# Altium project Wally_BMS.PrjPcb (part 1 of 3)
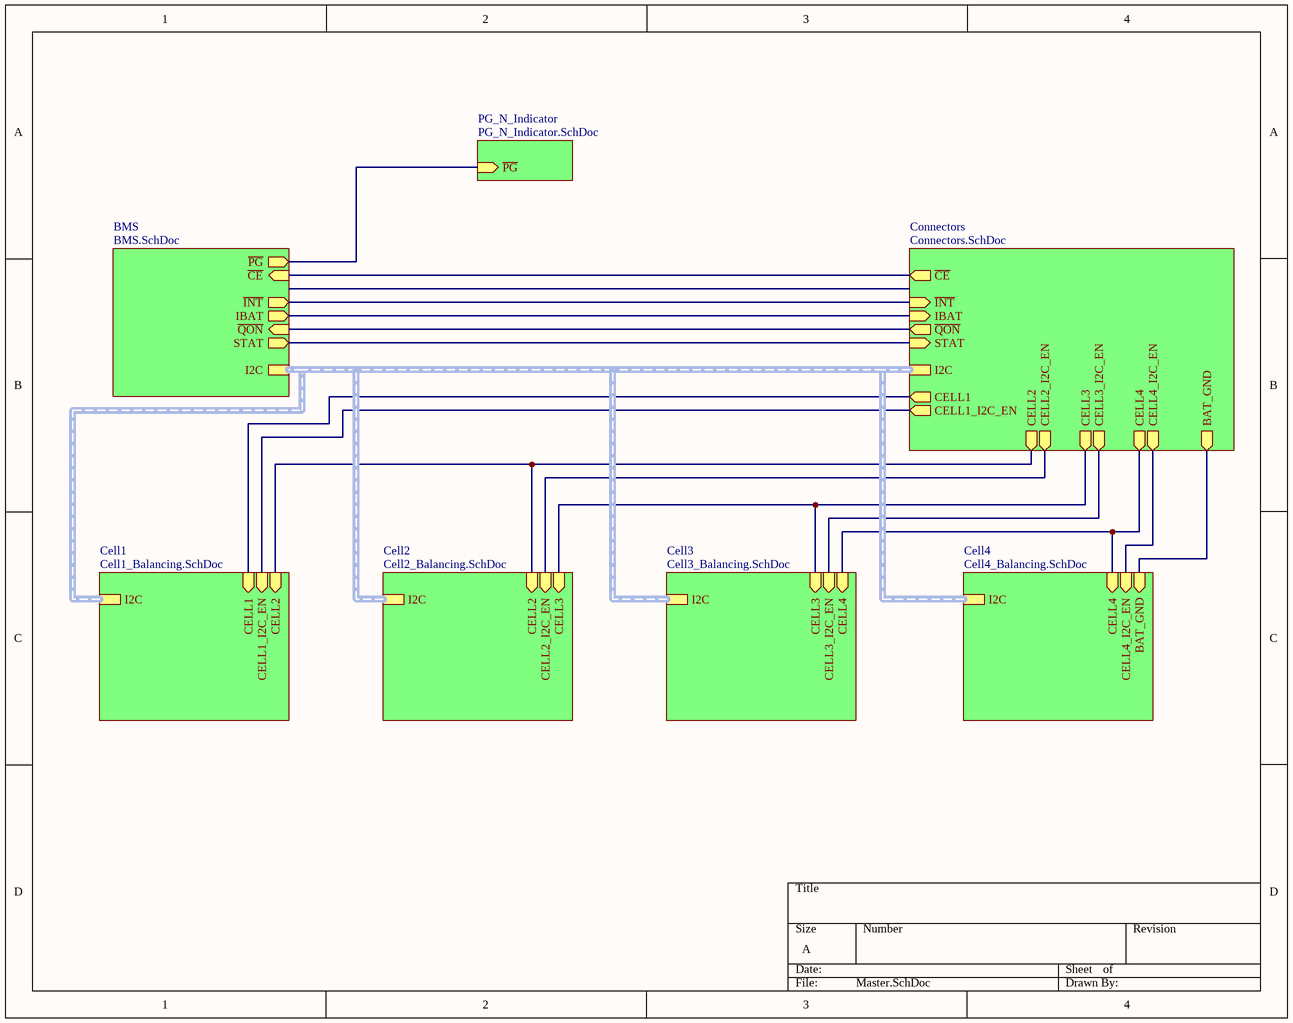
[diagram p0: Master.SchDoc]
8 sheets, 160 parts. Net scope: hierarchical (ports join the sheet entries above them; power ports are global).
Board file: Wally_BMS.PcbDoc
Sheets:
  Master.SchDoc
    BMS = BMS.SchDoc
    Connectors = Connectors.SchDoc
    Cell1 = Cell1_Balancing.SchDoc
    Cell2 = Cell2_Balancing.SchDoc
    Cell3 = Cell3_Balancing.SchDoc
    Cell4 = Cell4_Balancing.SchDoc
    PG_N_Indicator = PG_N_Indicator.SchDoc

## Sheet Master.SchDoc
size A; DocumentNumber: 1; SheetNumber: 1; SheetTotal: 7

### Sub-sheets
BMS = BMS.SchDoc: ~{CE} (in), I2C (harness I2C), ~{INT} (out), IBAT (out), ~{QON} (in), STAT (out), ~{PG} (out)
Cell1 = Cell1_Balancing.SchDoc: I2C (harness I2C), CELL1 (in), CELL2 (in), CELL1_I2C_EN (in)
Cell2 = Cell2_Balancing.SchDoc: I2C (harness I2C), CELL3 (in), CELL2_I2C_EN (in), CELL2 (in)
Cell3 = Cell3_Balancing.SchDoc: I2C (harness I2C), CELL4 (in), CELL3_I2C_EN (in), CELL3 (in)
Cell4 = Cell4_Balancing.SchDoc: BAT_GND (in), CELL4_I2C_EN (in), CELL4 (in), I2C (harness I2C)
Connectors = Connectors.SchDoc: ~{CE} (out), I2C (harness I2C), ~{INT} (in), IBAT (in), ~{QON} (out), STAT (in), CELL1_I2C_EN (out), CELL1 (out), CELL2_I2C_EN (out), CELL2 (out), CELL3_I2C_EN (out), CELL3 (out), CELL4_I2C_EN (out), CELL4 (out), BAT_GND (out)
PG_N_Indicator = PG_N_Indicator.SchDoc: ~{PG} (in)

### Nets
~{CE}: sheet BMS/~{CE}, sheet Connectors/~{CE}
~{INT}: sheet BMS/~{INT}, sheet Connectors/~{INT}
~{PG}: sheet BMS/~{PG}, sheet PG_N_Indicator/~{PG}
~{QON}: sheet BMS/~{QON}, sheet Connectors/~{QON}
BAT_GND: sheet Connectors/BAT_GND, sheet Cell4/BAT_GND
CELL1: sheet Connectors/CELL1, sheet Cell1/CELL1
CELL1_I2C_EN: sheet Connectors/CELL1_I2C_EN, sheet Cell1/CELL1_I2C_EN
CELL2: sheet Connectors/CELL2, sheet Cell1/CELL2, sheet Cell2/CELL2
CELL2_I2C_EN: sheet Connectors/CELL2_I2C_EN, sheet Cell2/CELL2_I2C_EN
CELL3: sheet Connectors/CELL3, sheet Cell2/CELL3, sheet Cell3/CELL3
CELL3_I2C_EN: sheet Connectors/CELL3_I2C_EN, sheet Cell3/CELL3_I2C_EN
CELL4: sheet Connectors/CELL4, sheet Cell3/CELL4, sheet Cell4/CELL4
CELL4_I2C_EN: sheet Connectors/CELL4_I2C_EN, sheet Cell4/CELL4_I2C_EN
IBAT: sheet BMS/IBAT, sheet Connectors/IBAT
STAT: sheet BMS/STAT, sheet Connectors/STAT

### Buses and harness runs
harness sheet BMS/I2C = sheet Cell1/I2C = sheet Cell2/I2C = sheet Cell3/I2C = sheet Cell4/I2C = sheet Connectors/I2C

## Sheet BMS.SchDoc
size A; DocumentNumber: 3; SheetNumber: 3; SheetTotal: 7
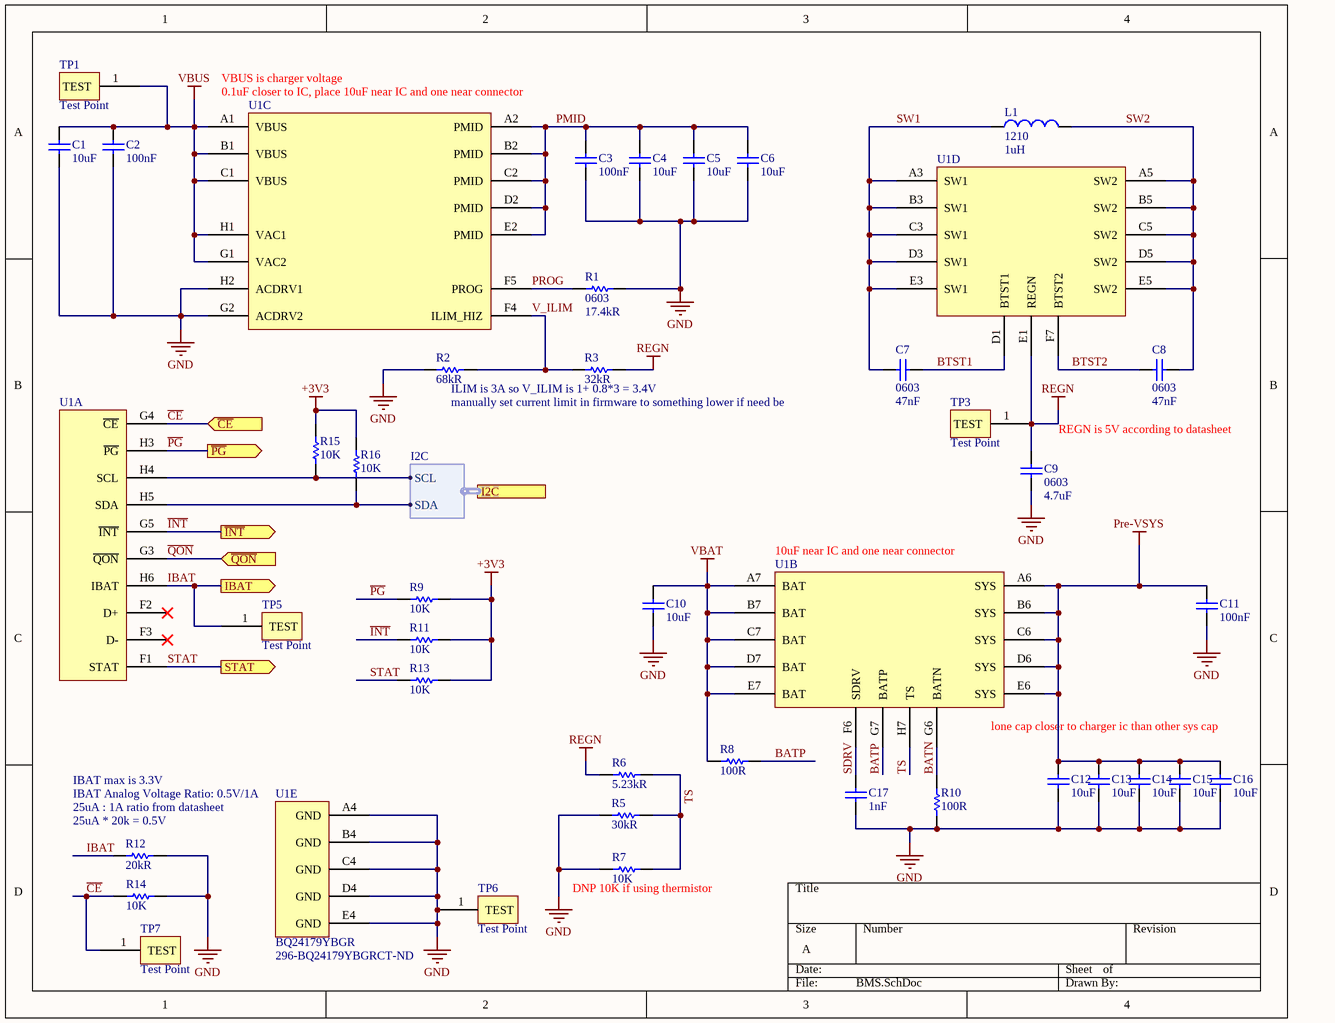
[diagram p1: BMS.SchDoc]

### Parts
C1  Capacitance: 10uF  [C0603]  (hidden comment: Capacitor 0603)
C2  Capacitance: 100nF  [C0402]  (hidden comment: Capacitor 0402)
C3  Capacitance: 100nF  [C0402]  (hidden comment: Capacitor 0402)
C4  Capacitance: 10uF  [C0603]  (hidden comment: Capacitor 0603)
C5  Capacitance: 10uF  [C0603]  (hidden comment: Capacitor 0603)
C6  Capacitance: 10uF  [C0603]  (hidden comment: Capacitor 0603)
C7  Package / Case: 0603  Capacitance: 47nF  [C0603]  (hidden comment: Capacitor 0603)
C8  Package / Case: 0603  Capacitance: 47nF  [C0603]  (hidden comment: Capacitor 0603)
C9  Package / Case: 0603  Capacitance: 4.7uF  [C0603]  (hidden comment: Capacitor 0603)
C10  Capacitance: 10uF  [C0603]  (hidden comment: Capacitor 0603)
C11  Capacitance: 100nF  [C0402]  (hidden comment: Capacitor 0402)
C12  Capacitance: 10uF  [C0603]  (hidden comment: Capacitor 0603)
C13  Capacitance: 10uF  [C0603]  (hidden comment: Capacitor 0603)
C14  Capacitance: 10uF  [C0603]  (hidden comment: Capacitor 0603)
C15  Capacitance: 10uF  [C0603]  (hidden comment: Capacitor 0603)
C16  Capacitance: 10uF  [C0603]  (hidden comment: Capacitor 0603)
C17  Capacitance: 1nF  [C0603]  (hidden comment: 478-1215-1-ND)
L1  Package / Case: 1210  Inductance: 1uH  [ind1210]  (hidden comment: Inductor 1210)
R1  Package / Case: 0603  Resistance: 17.4kR  [RES0603]  (hidden comment: Resistor 0603)
R2  Resistance: 68kR  [RES0402]  (hidden comment: Resistor 0402)
R3  Resistance: 32kR  [RES0402]  (hidden comment: Resistor 0402)
R5  Resistance: 30kR  [RES0402]  (hidden comment: Resistor 0402)
R6  Resistance: 5.23kR  [RES0402]  (hidden comment: Resistor 0402)
R7  Resistance (Ohms): 10K  [RES0603]  (hidden comment: ERJ-PB3B1002V)
R8  Resistance: 100R  [RES0603]  (hidden comment: Resistor 0603)
R9  Resistance (Ohms): 10K  [RES0603]  (hidden comment: ERJ-PB3B1002V)
R10  Resistance: 100R  [RES0603]  (hidden comment: Resistor 0603)
R11  Resistance (Ohms): 10K  [RES0603]  (hidden comment: ERJ-PB3B1002V)
R12  Resistance: 20kR  [RES0603]  (hidden comment: Resistor 0603)
R13  Resistance (Ohms): 10K  [RES0603]  (hidden comment: ERJ-PB3B1002V)
R14  Resistance (Ohms): 10K  [RES0603]  (hidden comment: ERJ-PB3B1002V)
R15  Resistance (Ohms): 10K  [RES0603]  (hidden comment: ERJ-PB3B1002V)
R16  Resistance (Ohms): 10K  [RES0603]  (hidden comment: ERJ-PB3B1002V)
TP1  Test Point  [TEST POINT]
TP3  Test Point  [TEST POINT]
TP5  Test Point  [TEST POINT]
TP6  Test Point  [TEST POINT]
TP7  Test Point  [TEST POINT]
U1  BQ24179YBGR  [BGA_79YBGR_TEX]  (value not drawn)  (parts A,B,C,D,E of 5)

### Ports
I2C (harness I2C), IBAT (out), STAT (out), ~{CE} (in), ~{INT} (out), ~{PG} (out), ~{QON} (in)

### Harnesses
I2C: SDA, SCL

### Nets
+3V3: R9.1 R11.1 R13.1 R15.1 R16.1
GND: C1.1 C2.1 C3.1 C4.1 C5.1 C6.1 C9.1 C10.1 C11.1 C12.1 C13.1 C14.1 C15.1 C16.1 C17.1 R1.1 R2.1 R5.1 R7.2 R10.1 R12.2 R14.1 TP6.1(TEST) U1.A4(GND) U1.B4(GND) U1.C4(GND) U1.D4(GND) U1.E4(GND) U1.G2(ACDRV2) U1.H2(ACDRV1)
Pre-VSYS: C11.2 C12.2 C13.2 C14.2 C15.2 C16.2 U1.A6(SYS) U1.B6(SYS) U1.C6(SYS) U1.D6(SYS) U1.E6(SYS)
REGN: C9.2 R3.2 R6.2 TP3.1(TEST) U1.E1(REGN)
VBAT: C10.2 R8.2 U1.A7(BAT) U1.B7(BAT) U1.C7(BAT) U1.D7(BAT) U1.E7(BAT)
VBUS: C1.2 C2.2 TP1.1(TEST) U1.A1(VBUS) U1.B1(VBUS) U1.C1(VBUS) U1.G1(VAC2) U1.H1(VAC1)
~{CE}: R14.2 TP7.1(TEST) U1.G4(~{CE}) ; port ~{CE}
~{INT}: R11.2 U1.G5(~{INT}) ; port ~{INT}
~{PG}: R9.2 U1.H3(~{PG}) ; port ~{PG}
~{QON}: U1.G3(~{QON}) ; port ~{QON}
BATN: R10.2 U1.G6(BATN)
BATP: R8.1 U1.G7(BATP)
BTST1: C7.2 U1.D1(BTST1)
BTST2: C8.1 U1.F7(BTST2)
IBAT: R12.1 TP5.1(TEST) U1.H6(IBAT) ; port IBAT
PMID: C3.2 C4.2 C5.2 C6.2 U1.A2(PMID) U1.B2(PMID) U1.C2(PMID) U1.D2(PMID) U1.E2(PMID)
PROG: R1.2 U1.F5(PROG)
SCL: R15.2 U1.H4(SCL) ; port I2C.SCL
SDA: R16.2 U1.H5(SDA) ; port I2C.SDA
SDRV: C17.2 U1.F6(SDRV)
STAT: R13.2 U1.F1(STAT) ; port STAT
SW1: C7.1 L1.1 U1.A3(SW1) U1.B3(SW1) U1.C3(SW1) U1.D3(SW1) U1.E3(SW1)
SW2: C8.2 L1.2 U1.A5(SW2) U1.B5(SW2) U1.C5(SW2) U1.D5(SW2) U1.E5(SW2)
TS: R5.2 R6.1 R7.1 U1.H7(TS)
V_ILIM: R2.2 R3.1 U1.F4(ILIM_HIZ)

Not connected (* = marked no-connect by the designer): U1 F2(D+)* F3(D-)*

### Notes on the sheet
- (near U1) VBUS is charger voltage
- (near U1) 0.1uF closer to IC, place 10uF near IC and one near connector
- ILIM is 3A so V_ILIM is 1+ 0.8*3 = 3.4V
- manually set current limit in firmware to something lower if need be
- REGN is 5V according to datasheet
- (near U1) 10uF near IC and one near connector
- (near U1) lone cap closer to charger ic than other sys cap
- IBAT Analog Voltage Ratio: 0.5V/1A
- (near R12) 25uA : 1A ratio from datasheet
- (near R12) 25uA * 20k = 0.5V
- IBAT max is 3.3V
- (near R7) DNP 10K if using thermistor

### Library data of the parts
C1 C4-C6 C10 C12-C16 = Capacitor 0603: Multilayer Ceramic Capacitors (High dielectric type), 25V, 10 uF, ± 20 %, 0603, X5R, RoHS; Manufacturer: Taiyo Yuden; Manufacturer Part Number: TMK107BBJ106MA-T; Tolerance: 20%; Package / Case: 0603; Supplier 1: Digi-Key; Supplier Part Number 1: 587-6023-1-ND; RoHS: Yes; Category: Ceramic Capacitors; Stock 1: 152813; Pricing 1: 1=0.46000, 10=0.32000, 50=0.22380, 100=0.19180, 500=0.14386, 1000=0.12149 (USD); Mount: Surface Mount; Case/Package: 0603; Case Code (Imperial): 0603; Case Code (Metric): 1608; Min Operating Temperature: -55°C; Max Operating Temperature: 85°C; Packaging: Tape and Reel; Voltage Rating: 25V; Lead Free: Lead Free; RoHS Compliant: Yes; ComponentLink1URL: http://ds.yuden.co.jp/TYCOMPAS/ut/detail.do?productNo=TMK107BBJ106MA-T&fileName=TMK107BBJ106MA-T_SS&mode=specSheetDownload&src-supplier=Digi-Key; ComponentLink1Description: http://ds.yuden.co.jp/TYCOMPAS/ut/detail.do?productNo=TMK107BBJ106MA-T&fileName=TMK107BBJ106MA-T_SS&mode=specSheetDownload&src-supplier=Digi-Key
C2 C3 C11 = Capacitor 0402: CAP CER 0.1UF 25V X5R 0402 / High Value Multilayer Ceramic Capacitors (High dielectric type); Manufacturer: Taiyo Yuden; Manufacturer Part Number: TMK105BJ104KV-F; Tolerance: 10%; Package / Case: 0402; Supplier 1: Digi-Key; Supplier Part Number 1: 587-1456-1-ND; RoHS: Yes; Category: Ceramic Capacitors; Stock 1: 2308231; Pricing 1: 1=0.10000, 10=0.04200, 50=0.02280, 100=0.01860, 500=0.01328, 1000=0.01044, 2500=0.00949, 5000=0.00873 (USD); Mount: Surface Mount; Case/Package: 0402; Number of Pins: 2; Case Code (Imperial): 0402; Case Code (Metric): 1005; Weight: 2.3E-05oz; Min Operating Temperature: -55°C; Max Operating Temperature: 85°C; Packaging: Tape and Reel; Dielectric: X5R; Voltage Rating (DC): 25V; Voltage Rating: 25V; Package Quantity: 1; Termination: SMD/SMT; Resistor Type: Ceramic; Voltage: 25V; Series: M; Construction: Flat; Length: 1mm; Width: 0.5mm; Height: 0.5mm; Depth: 0.5mm; Thickness: 0.022inch; REACH SVHC: No SVHC; Lead Free: Lead Free; Halogen Free: Halogen Free; RoHS Compliant: Yes; ComponentLink1URL: https://datasheet.ciiva.com/131/tmk105bj104kv-f-ss-131420.pdf?src-supplier=Digi-Key; ComponentLink1Description: https://datasheet.ciiva.com/131/tmk105bj104kv-f-ss-131420.pdf?src-supplier=Digi-Key; ComponentLink2URL: https://datasheet.ciiva.com/15922/28tmk105bj104kv-f-15922315.pdf?src-supplier=Onlinecomponents.com; ComponentLink2Description: https://datasheet.ciiva.com/15922/28tmk105bj104kv-f-15922315.pdf?src-supplier=Onlinecomponents.com; ComponentLink3URL: https://datasheet.ciiva.com/30051/25tmk105bj104kv-f-30051094.pdf?src-supplier=Onlinecomponents.com; ComponentLink3Description: https://datasheet.ciiva.com/30051/25tmk105bj104kv-f-30051094.pdf?src-supplier=Onlinecomponents.com; ComponentLink4URL: https://datasheet.ciiva.com/22768/1693457-22768649.pdf?src-supplier=Farnell; ComponentLink4Description: https://datasheet.ciiva.com/22768/1693457-22768649.pdf?src-supplier=Farnell
C7 C8 = Capacitor 0603: Cap Ceramic 0.047uF 50V X7R 10% SMD 0603 125°C Paper T/R; Manufacturer: KEMET; Manufacturer Part Number: C0603C473K5RAC7411; Supplier 1: Digi-Key; Supplier Part Number 1: 399-C0603C473K5RAC7411CT-ND; RoHS: Yes; Category: Ceramic Capacitors; Stock 1: 53312; Pricing 1: 1=0.10000, 10=0.07100, 50=0.03860, 100=0.03160, 500=0.02254, 1000=0.01771, 2500=0.01610, 5000=0.01481 (USD); Mount: Surface Mount; Case/Package: 0603; Dielectric Material: Ceramic; Min Operating Temperature: -55°C; Max Operating Temperature: 125°C; Tolerance: 10%; Dielectric: X7R; Voltage Rating (DC): 50V; Construction: Flat; Length: 1.6mm; Height: 0.8mm; Depth: 0.8mm; Radiation Hardening: No; RoHS Compliant: Yes; ComponentLink1URL: http://capacitoredge.kemet.com/capedge2/DataSheet?pn=C0603C473K5RAC7411&src-supplier=Avnet; ComponentLink1Description: http://capacitoredge.kemet.com/capedge2/DataSheet?pn=C0603C473K5RAC7411&src-supplier=Avnet; ComponentLink2URL: http://capacitoredge.kemet.com/capedge2/DataSheet?pn=C0603C473K5RAC7411&src-supplier=Avnet+Europe; ComponentLink2Description: http://capacitoredge.kemet.com/capedge2/DataSheet?pn=C0603C473K5RAC7411&src-supplier=Avnet+Europe
C9 = Capacitor 0603: CAP CER 4.7UF 25V X5R 0603; Manufacturer: TDK; Manufacturer Part Number: C1608X5R1E475M080AC; Dielectric Material: Ceramic; Tolerance: 20%; Supplier 1: Digi-Key; Supplier Part Number 1: 445-9040-1-ND; RoHS: Yes; Category: Ceramic Capacitors; Stock 1: 163174; Pricing 1: 1=0.38000, 10=0.25800, 50=0.17200, 100=0.14620, 500=0.10322, 1000=0.09032 (USD); Mount: Surface Mount; Case/Package: 0603; Case Code (Metric): 1608; Case Code (Imperial): 0603; Weight: 7.1E-05oz; Min Operating Temperature: -55°C; Max Operating Temperature: 85°C; Voltage Rating (DC): 25V; Packaging: Tape and Reel; Voltage Rating: 25V; Termination: SMD/SMT; Series: C; Package Quantity: 1; Dielectric: X5R; Resistor Type: Ceramic; Length: 1.6mm; Width: 0.031inch; Height: 0.8mm; Thickness: 0.039inch; Depth: 0.8mm; Radiation Hardening: No; REACH SVHC: No SVHC; Lead Free: Lead Free; RoHS Compliant: Yes; ComponentLink1URL: https://datasheet.ciiva.com/15192/getdatasheetpartid-726745-15192019.pdf?src-supplier=Verical; ComponentLink1Description: https://datasheet.ciiva.com/15192/getdatasheetpartid-726745-15192019.pdf?src-supplier=Verical
C17 = 06035C102KAT2A: CAP CER 1000PF 50V X7R 0603; Tolerance: ±20%; Applications: General Purpose; Supplier 1: Digi-Key; Supplier Part Number 1: 478-1215-1-ND; Voltage - Rated: 50V; Package / Case: 0603
L1 = Inductor 1210: Inductor Power Shielded Wirewound 1uH 20% 1MHz Metal 4.1A 0.022Ohm DCR 1210 Automotive T/R; Manufacturer: Murata; Manufacturer Part Number: DFE322520FD-1R0M=P2; Supplier 1: Digi-Key; Supplier Part Number 1: 490-18403-1-ND; RoHS: Yes; Category: Fixed Inductors; Stock 1: 831; Pricing 1: 1=0.99000, 10=0.86600, 25=0.80440, 50=0.68060, 100=0.61880, 250=0.58164, 500=0.51976, 1000=0.42075 (USD)
R1 = Resistor 0603: Res Thick Film 0603 17.4K Ohm 1% 0.1W(1/10W) ±100ppm/°C Pad SMD Automotive T/R; Manufacturer: Stackpole Electronics; Manufacturer Part Number: RMCF0603FT17K4; Power Rating: 100mW; Supplier 1: Digi-Key; Supplier Part Number 1: RMCF0603FT17K4CT-ND; RoHS: Yes; Category: Chip SMD Resistors; Stock 1: 31336; Pricing 1: 1=0.10000, 10=0.01700, 100=0.00680, 1000=0.00305, 2500=0.00264 (USD); Mount: Surface Mount; Case/Package: 0603; Case Code (Metric): 1608; Case Code (Imperial): 0603; Contact Plating: Tin,Matte; Size Code: 0603; Min Operating Temperature: -55°C; Max Operating Temperature: 155°C; Tolerance: 1%; Packaging: Tape and Reel; Resistor Type: Thick Film; Number of Terminations: 2; Max Power Dissipation: 100mW; Temperature Coefficient: 100ppm/°C; Features: Automotive AEC-Q200; Series: RMCF; Length: 0.061inch; Width: 0.031inch; Height: 0.022inch; Radiation Hardening: No; Lead Free: Lead Free; RoHS Compliant: Yes; ComponentLink1URL: https://www.seielect.com/catalog/SEI-RMCF_RMCP.pdf?src-supplier=Avnet; ComponentLink1Description: https://www.seielect.com/catalog/SEI-RMCF_RMCP.pdf?src-supplier=Avnet; ComponentLink2URL: https://www.seielect.com/catalog/SEI-Packaging.pdf?src-supplier=Digi-Key; ComponentLink2Description: https://www.seielect.com/catalog/SEI-Packaging.pdf?src-supplier=Digi-Key; ComponentLink3URL: http://www.seielect.com/Catalog/SEI-RMC.pdf?src-supplier=Future+Electronics; ComponentLink3Description: http://www.seielect.com/Catalog/SEI-RMC.pdf?src-supplier=Future+Electronics
R2 = Resistor 0402: Res Thin Film 0402 68K Ohm 0.1% 0.063W ±25ppm/°C Molded SMD Punched Carrier T/R; Manufacturer: Panasonic; Manufacturer Part Number: ERA-2AEB683X; Voltage Rating: 25V; Power Rating: 63mW; Package / Case: 0402; Supplier 1: Digi-Key; Supplier Part Number 1: P68KDCCT-ND; RoHS: Yes; Category: Chip SMD Resistors; Stock 1: 50182; Pricing 1: 1=0.41000, 10=0.29200, 100=0.11660, 1000=0.05748, 2500=0.05325, 5000=0.04818 (USD); Mount: Surface Mount; Case/Package: 0402; Number of Pins: 2; Contact Plating: Tin; Case Code (Metric): 1005; Case Code (Imperial): 0402; Min Operating Temperature: -55°C; Max Operating Temperature: 155°C; Tolerance: 0.1%; Resistor Type: Thin Film; Temperature Coefficient: 25ppm/°C; Packaging: Tape and Reel; Package Quantity: 10000; Number of Terminations: 2; Termination: SMD/SMT; Max Power Dissipation: 63mW; Voltage Rating (DC): 25V; Series: ERA-2A; Resistance Tolerance: 0.1%; Construction: Rectangular; Technology: METAL FILM; Length: 1mm; Width: 0.02inch; Height: 0.35mm; Depth: 0.5mm; Radiation Hardening: No; REACH SVHC: Unknown; Military Standard: Not; Lead Free: Lead Free; RoHS Compliant: Yes; ComponentLink1URL: https://datasheet.ciiva.com/11811/0900766b80beefcc-11811797.pdf?src-supplier=RSComponents; ComponentLink1Description: https://datasheet.ciiva.com/11811/0900766b80beefcc-11811797.pdf?src-supplier=RSComponents; ComponentLink2URL: https://datasheet.ciiva.com/6000/328837-6000892.pdf?src-supplier=Farnell; ComponentLink2Description: https://datasheet.ciiva.com/6000/328837-6000892.pdf?src-supplier=Farnell; ComponentLink3URL: https://datasheet.ciiva.com/7886/328837-7886575.pdf?src-supplier=Element14; ComponentLink3Description: https://datasheet.ciiva.com/7886/328837-7886575.pdf?src-supplier=Element14; ComponentLink4URL: https://datasheet.ciiva.com/6000/328837-6000893.pdf?src-supplier=Farnell; ComponentLink4Description: https://datasheet.ciiva.com/6000/328837-6000893.pdf?src-supplier=Farnell; ComponentLink5URL: https://datasheet.ciiva.com/46422/328837-46422458.pdf?src-supplier=Element14; ComponentLink5Description: https://datasheet.ciiva.com/46422/328837-46422458.pdf?src-supplier=Element14; ComponentLink6URL: https://datasheet.ciiva.com/22739/1776116-22739286.pdf?src-supplier=Element14; ComponentLink6Description: https://datasheet.ciiva.com/22739/1776116-22739286.pdf?src-supplier=Element14; ComponentLink7URL: https://datasheet.ciiva.com/28692/1776116-28692809.pdf?src-supplier=Element14; ComponentLink7Description: https://datasheet.ciiva.com/28692/1776116-28692809.pdf?src-supplier=Element14; ComponentLink8URL: https://datasheet.ciiva.com/24071/aoa0000ce26-197354-24071367.pdf?src-supplier=Mouser; ComponentLink8Description: https://datasheet.ciiva.com/24071/aoa0000ce26-197354-24071367.pdf?src-supplier=Mouser; ComponentLink9URL: https://datasheet.ciiva.com/9188/aoa0000ce26-9188063.pdf?src-supplier=Avnet; ComponentLink9Description: https://datasheet.ciiva.com/9188/aoa0000ce26-9188063.pdf?src-supplier=Avnet; ComponentLink10URL: https://datasheet.ciiva.com/30189/54aoa0000ce26-30189992.pdf?src-supplier=Onlinecomponents.com; ComponentLink10Description: https://datasheet.ciiva.com/30189/54aoa0000ce26-30189992.pdf?src-supplier=Onlinecomponents.com
R3 = Resistor 0402: Res, 32K, 1%, 0.063W, 0402 Rohs Compliant: Yes; Manufacturer: KOA Speer; Manufacturer Part Number: RN73H1ETTP3202F50; Power Rating: 63mW; Voltage Rating: 50V; Temperature Coefficient: 50ppm/°C; Package / Case: 0402; Supplier 1: Digi-Key; Supplier Part Number 1: 2019-RN73H1ETTP3202F50CT-ND; RoHS: Yes; Category: Chip SMD Resistors; Stock 1: 33713; Pricing 1: 1=0.46000, 10=0.35500, 100=0.14920, 1000=0.08232, 2500=0.07718, 5000=0.06946 (USD); Case/Package: 0402; Case Code (Imperial): 0402; Case Code (Metric): 1005; Min Operating Temperature: -55°C; Max Operating Temperature: 155°C; Packaging: Tape and Reel; Tolerance: 1%; Termination: SMD/SMT; Resistor Type: Metal Film; Voltage Rating (DC): 50V; Series: RN73H; Length: 1mm; Width: 0.5mm; Height: 0.35mm; ComponentLink1URL: https://datasheet.ciiva.com/12784/rn73h-12784440.pdf?src-supplier=Mouser; ComponentLink1Description: https://datasheet.ciiva.com/12784/rn73h-12784440.pdf?src-supplier=Mouser
R5 = Resistor 0402: Res Thick Film 0402 30K Ohm 5% 0.063W(1/16W) ±100ppm/C Pad SMD Automotive T/R; Manufacturer: Stackpole Electronics; Manufacturer Part Number: RMCF0402JT30K0; Max Power Dissipation: 63mW; Temperature Coefficient: 100ppm/°C; Package / Case: 0402; Supplier 1: Digi-Key; Supplier Part Number 1: RMCF0402JT30K0CT-ND; RoHS: Yes; Category: Chip SMD Resistors; Stock 1: 49900; Pricing 1: 1=0.10000, 10=0.01200, 100=0.00470, 1000=0.00213, 2500=0.00185, 5000=0.00153 (USD); Mount: Surface Mount; Case/Package: 0402; Case Code (Metric): 1005; Case Code (Imperial): 0402; Contact Plating: Tin,Matte; Min Operating Temperature: -55°C; Max Operating Temperature: 155°C; Packaging: Tape and Reel; Tolerance: 5%; Resistor Type: Thick Film; Number of Terminations: 2; Features: Automotive AEC-Q200; Series: RMCF; Length: 0.039inch; Width: 0.02inch; Height: 0.016inch; Lead Free: Lead Free; RoHS Compliant: Yes; ComponentLink1URL: https://www.seielect.com/Catalog/SEI-RMCF_RMCP.pdf?src-supplier=Avnet; ComponentLink1Description: https://www.seielect.com/Catalog/SEI-RMCF_RMCP.pdf?src-supplier=Avnet; ComponentLink2URL: https://www.seielect.com/Catalog/SEI-RMCF_RMCP.pdf?src-supplier=Digi-Key; ComponentLink2Description: https://www.seielect.com/Catalog/SEI-RMCF_RMCP.pdf?src-supplier=Digi-Key; ComponentLink3URL: https://www.seielect.com/catalog/SEI-Packaging.pdf?src-supplier=Digi-Key; ComponentLink3Description: https://www.seielect.com/catalog/SEI-Packaging.pdf?src-supplier=Digi-Key
R6 = Resistor 0402: Res Thick Film 0402 5.23K Ohm 1% 0.063W ±100ppm/°C Molded SMD Paper T/R; Manufacturer: Stackpole Electronics; Manufacturer Part Number: RMCF0402FT5K23; Max Power Dissipation: 63mW; Package / Case: 0402; Supplier 1: Digi-Key; Supplier Part Number 1: RMCF0402FT5K23CT-ND; RoHS: Yes; Category: Chip SMD Resistors; Stock 1: 68865; Pricing 1: 1=0.10000, 10=0.01500, 100=0.00610, 1000=0.00274, 2500=0.00238, 5000=0.00197 (USD); Mount: Surface Mount; Case/Package: 0402; Case Code (Metric): 1005; Case Code (Imperial): 0402; Contact Plating: Tin,Matte; Min Operating Temperature: -55°C; Max Operating Temperature: 155°C; Tolerance: 1%; Packaging: Tape and Reel; Resistor Type: Thick Film; Number of Terminations: 2; Temperature Coefficient: 100ppm/°C; Features: Automotive AEC-Q200; Series: RMCF; Length: 0.039inch; Width: 0.02inch; Height: 0.016inch; Radiation Hardening: No; Lead Free: Lead Free; RoHS Compliant: Yes; ComponentLink1URL: https://www.seielect.com/catalog/SEI-RMCF_RMCP.pdf?src-supplier=Avnet; ComponentLink1Description: https://www.seielect.com/catalog/SEI-RMCF_RMCP.pdf?src-supplier=Avnet; ComponentLink2URL: https://www.seielect.com/Catalog/SEI-RMCF_RMCP.pdf?src-supplier=Digi-Key; ComponentLink2Description: https://www.seielect.com/Catalog/SEI-RMCF_RMCP.pdf?src-supplier=Digi-Key; ComponentLink3URL: https://www.seielect.com/catalog/SEI-Packaging.pdf?src-supplier=Digi-Key; ComponentLink3Description: https://www.seielect.com/catalog/SEI-Packaging.pdf?src-supplier=Digi-Key
R7 R9 R11 R13-R16 = ERJ-PB3B1002V: RES SMD 10K OHM 5% 1/4W 0603; Power (Watts): 0.1W, 1/10W; Tolerance: ±1%; Supplier 1: Digi-Key; Supplier Part Number 1: P20086CT-ND; Package / Case: 0603
R8 R10 = Resistor 0603: Res Thick Film 0603 100 Ohm 1% 0.1W(1/10W) ±100ppm/°C Pad SMD Automotive T/R; Manufacturer: Stackpole Electronics; Manufacturer Part Number: RMCF0603FT100R; Power Rating: 100mW; Package / Case: 0603; Supplier 1: Digi-Key; Supplier Part Number 1: RMCF0603FT100RCT-ND; RoHS: Yes; Category: Chip SMD Resistors; Stock 1: 828887; Pricing 1: 1=0.10000, 10=0.01700, 100=0.00680, 1000=0.00305, 2500=0.00264 (USD); Mount: Surface Mount; Case/Package: 0603; Case Code (Metric): 1608; Case Code (Imperial): 0603; Contact Plating: Tin,Matte; Size Code: 0603; Min Operating Temperature: -55°C; Max Operating Temperature: 155°C; Tolerance: 1%; Packaging: Tape and Reel; Resistor Type: Thick Film; Number of Terminations: 2; Max Power Dissipation: 100mW; Temperature Coefficient: 100ppm/°C; Features: Automotive AEC-Q200; Series: RMCF; Construction: Rectangular; Length: 1.55mm; Width: 0.031inch; Height: 0.022inch; Depth: 0.8mm; Radiation Hardening: No; Military Standard: Not; Lead Free: Lead Free; RoHS Compliant: Yes; ComponentLink1URL: https://datasheet.ciiva.com/15215/getdatasheetpartid-360413-15215981.pdf?src-supplier=Verical; ComponentLink1Description: https://datasheet.ciiva.com/15215/getdatasheetpartid-360413-15215981.pdf?src-supplier=Verical
R12 = Resistor 0603: Res Thick Film 0603 20K Ohm 1% 0.1W(1/10W) ±100ppm/C Pad SMD Automotive T/R; Manufacturer: Stackpole Electronics; Manufacturer Part Number: RMCF0603FT20K0; Power Rating: 100mW; Temperature Coefficient: 100ppm/°C; Package / Case: 0603; Supplier 1: Digi-Key; Supplier Part Number 1: RMCF0603FT20K0CT-ND; RoHS: Yes; Category: Chip SMD Resistors; Stock 1: 1257328; Pricing 1: 1=0.10000, 10=0.01700, 100=0.00680, 1000=0.00305, 2500=0.00264 (USD); Mount: Surface Mount; Case/Package: 0603; Case Code (Metric): 1608; Case Code (Imperial): 0603; Contact Plating: Tin,Matte; Size Code: 0603; Min Operating Temperature: -55°C; Max Operating Temperature: 155°C; Tolerance: 1%; Packaging: Tape and Reel; Resistor Type: Thick Film; Number of Terminations: 2; Max Power Dissipation: 100mW; Features: Automotive AEC-Q200; Series: RMCF; Construction: Rectangular; Length: 1.55mm; Width: 0.031inch; Height: 0.022inch; Depth: 0.8mm; Radiation Hardening: No; Military Standard: Not; Lead Free: Lead Free; RoHS Compliant: Yes; ComponentLink1URL: https://datasheet.ciiva.com/15193/getdatasheetpartid-359905-15193453.pdf?src-supplier=Verical; ComponentLink1Description: https://datasheet.ciiva.com/15193/getdatasheetpartid-359905-15193453.pdf?src-supplier=Verical
U1 = BQ24179YBGR: INTEGRATED, NVDC, 5-A 1-CELL TO; Manufacturer: Texas Instruments; Supplier 1: Digi-Key; Manufacturer Part Number: BQ24179YBGR; RoHS: Yes; Stock 1: 2424; Pricing 1: 1=6.36000, 10=5.74300, 25=5.47600, 100=4.75470, 250=4.54104, 500=4.41000 (USD); Supplier Part Number 1: 296-BQ24179YBGRCT-ND

## Sheet Connectors.SchDoc
size A; DocumentNumber: 2; SheetNumber: 2; SheetTotal: 7
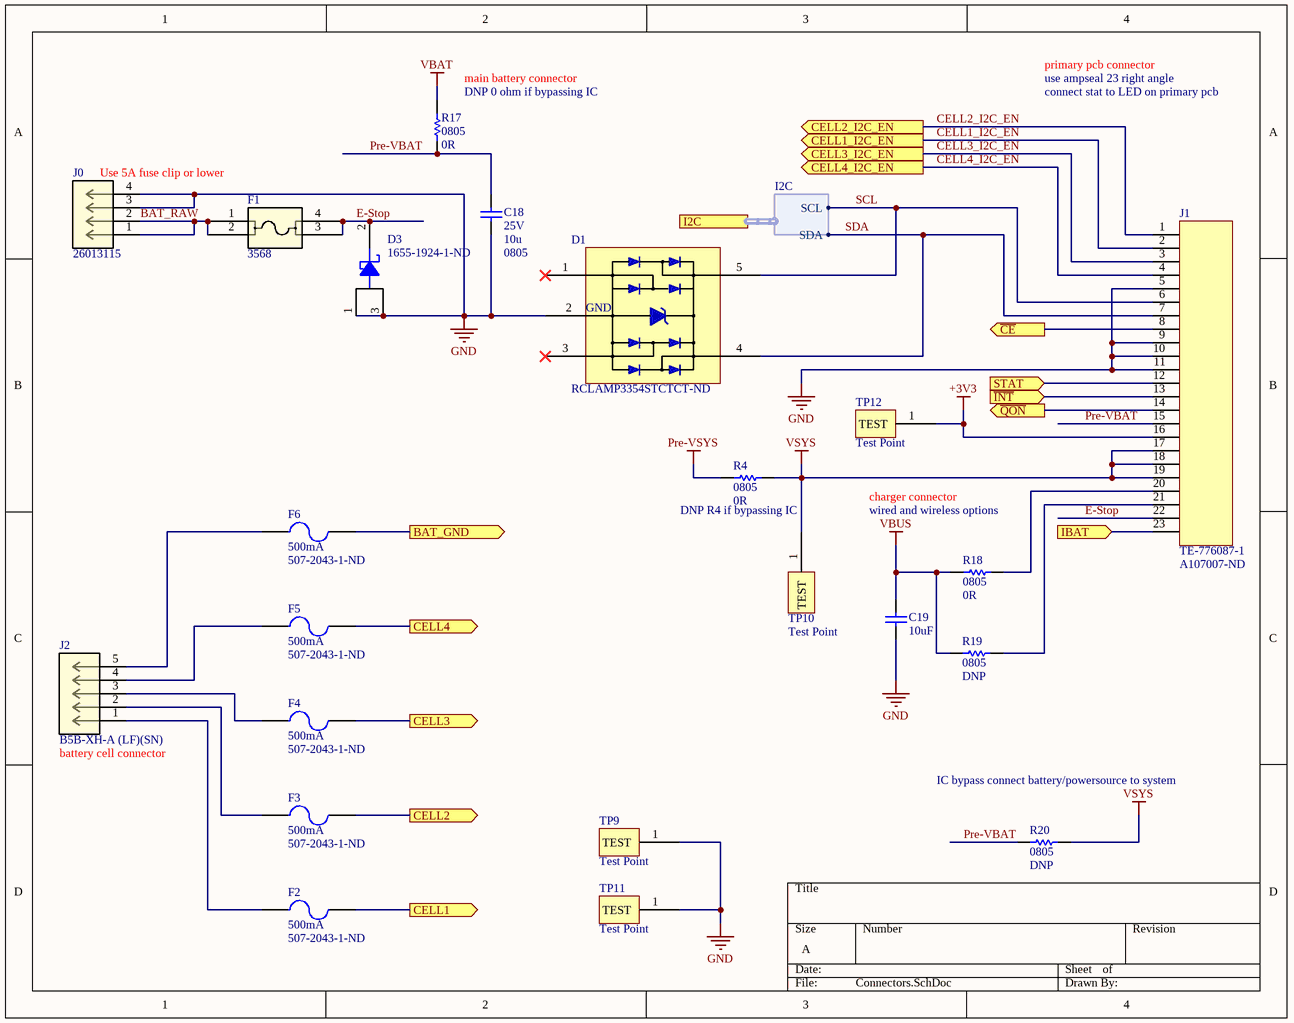
[diagram p2: Connectors.SchDoc]

### Parts
C18  Voltage - Rated: 25V  Capacitance: 10u  Package / Case: 0805  [C0805]  (hidden comment: GRM21BR61E106MA73L)
C19  Capacitance: 10uF  [C0603]  (hidden comment: Capacitor 0603)
D1  Supplier Part Number 1: RCLAMP3354STCTCT-ND  [SOT95P280X145-5N]  (hidden comment: RCLAMP3354S.TCT)
D3  1655-1924-1-ND  [50WQ06FNTR]
F1  3568  [3568_KEY]
F2  Current Rating: 500mA  Supplier Part Number 1: 507-2043-1-ND  [Bel Fuse Inc. 0679H0500-05]  (hidden comment: Bel Fuse Inc. 0679H0500-05)
F3  Current Rating: 500mA  Supplier Part Number 1: 507-2043-1-ND  [Bel Fuse Inc. 0679H0500-05]  (hidden comment: Bel Fuse Inc. 0679H0500-05)
F4  Current Rating: 500mA  Supplier Part Number 1: 507-2043-1-ND  [Bel Fuse Inc. 0679H0500-05]  (hidden comment: Bel Fuse Inc. 0679H0500-05)
F5  Current Rating: 500mA  Supplier Part Number 1: 507-2043-1-ND  [Bel Fuse Inc. 0679H0500-05]  (hidden comment: Bel Fuse Inc. 0679H0500-05)
F6  Current Rating: 500mA  Supplier Part Number 1: 507-2043-1-ND  [Bel Fuse Inc. 0679H0500-05]  (hidden comment: Bel Fuse Inc. 0679H0500-05)
J0  26013115  [CON_26013115]
J1  TE-776087-1  Supplier Part Number 1: A107007-ND  [TE-776087-1]
J2  B5B-XH-A (LF)(SN)  [CONN_B5B-XH-A (LF)(SN)_JST]
R4  Package / Case: 0805  Resistance: 0R  [RES0805]  (hidden comment: Resistor 0805)
R17  Package / Case: 0805  Resistance: 0R  [RES0805]  (hidden comment: Resistor 0805)
R18  Package / Case: 0805  Resistance: 0R  [RES0805]  (hidden comment: Resistor 0805)
R19  Package / Case: 0805  [RES0805]  (hidden comment: Resistor 0805)
R20  Package / Case: 0805  [RES0805]  (hidden comment: Resistor 0805)
TP9  Test Point  [TEST POINT]
TP10  Test Point  [TEST POINT]
TP11  Test Point  [TEST POINT]
TP12  Test Point  [TEST POINT]

### Ports
BAT_GND (out), CELL1 (out), CELL1_I2C_EN (out), CELL2 (out), CELL2_I2C_EN (out), CELL3 (out), CELL3_I2C_EN (out), CELL4 (out), CELL4_I2C_EN (out), I2C (harness I2C), IBAT (in), STAT (in), ~{CE} (out), ~{INT} (in), ~{QON} (out)

### Harnesses
I2C: SDA, SCL

### Nets
+3V3: J1.16 TP12.1(TEST)
GND: C18.1 C19.1 D1.2(GND) D3.1(ANODE) D3.3(ANODE) J0.3 J0.4 J1.5 J1.9 J1.10 J1.11 TP9.1(TEST) TP11.1(TEST)
Pre-VSYS: R4.2
VBAT: R17.2
VBUS: C19.2 R18.2 R19.1
VSYS: J1.17 J1.18 J1.19 R4.1 R20.2 TP10.1(TEST)
~{CE}: J1.8 ; port ~{CE}
~{INT}: J1.13 ; port ~{INT}
~{QON}: J1.14 ; port ~{QON}
BAT_GND: F6.2 ; port BAT_GND
BAT_RAW: F1.1 F1.2 J0.1 J0.2
CELL1: F2.2 ; port CELL1
CELL1_I2C_EN: J1.2 ; port CELL1_I2C_EN
CELL2: F3.2 ; port CELL2
CELL2_I2C_EN: J1.1 ; port CELL2_I2C_EN
CELL3: F4.2 ; port CELL3
CELL3_I2C_EN: J1.3 ; port CELL3_I2C_EN
CELL4: F5.2 ; port CELL4
CELL4_I2C_EN: J1.4 ; port CELL4_I2C_EN
E-Stop: D3.2(CATHODE) F1.3 F1.4 J1.22
IBAT: J1.23 ; port IBAT
Pre-VBAT: C18.2 J1.15 R17.1 R20.1
SCL: D1.5 J1.6 ; port I2C.SCL
SDA: D1.4 J1.7 ; port I2C.SDA
STAT: J1.12 ; port STAT
NetF2_1: F2.1 J2.1
NetF3_1: F3.1 J2.2
NetF4_1: F4.1 J2.3
NetF5_1: F5.1 J2.4
NetF6_1: F6.1 J2.5
NetJ1_20: J1.20 R18.1
NetJ1_21: J1.21 R19.2

Not connected (* = marked no-connect by the designer): D1 1* 3*

### Notes on the sheet
- (near R17) main battery connector
- (near R17) DNP 0 ohm if bypassing IC
- primary pcb connector
- use ampseal 23 right angle
- connect stat to LED on primary pcb
- (near J0) Use 5A fuse clip or lower
- charger connector
- (near R4) DNP R4 if bypassing IC
- wired and wireless options
- (near J2) battery cell connector
- IC bypass connect battery/powersource to system

### Library data of the parts
C18 = GRM21BR61E106MA73L: CAP SMD 10uF +/-20% 25V 0805; Tolerance: ±20%; Applications: General Purpose; Supplier 1: Digi-Key; Supplier Part Number 1: 490-10748-1-ND
C19 = Capacitor 0603: as C1 on sheet BMS; Package / Case: 0603; Supplier 1: Digi-Key; Supplier Part Number 1: 587-6023-1-ND; RoHS: Yes; Category: Ceramic Capacitors; Stock 1: 152813; Pricing 1: 1=0.46000, 10=0.32000, 50=0.22380, 100=0.19180, 500=0.14386, 1000=0.12149 (USD); Mount: Surface Mount; Case/Package: 0603; Case Code (Imperial): 0603; Case Code (Metric): 1608; Min Operating Temperature: -55°C; Max Operating Temperature: 85°C; Packaging: Tape and Reel; Voltage Rating: 25V; Lead Free: Lead Free; RoHS Compliant: Yes; ComponentLink1URL: http://ds.yuden.co.jp/TYCOMPAS/ut/detail.do?productNo=TMK107BBJ106MA-T&fileName=TMK107BBJ106MA-T_SS&mode=specSheetDownload&src-supplier=Digi-Key; ComponentLink1Description: http://ds.yuden.co.jp/TYCOMPAS/ut/detail.do?productNo=TMK107BBJ106MA-T&fileName=TMK107BBJ106MA-T_SS&mode=specSheetDownload&src-supplier=Digi-Key
D1 = RCLAMP3354S.TCT: TVS DIODE 3.3VWM 16VC; Supplier 1: Digi-Key
D3 = 50WQ06FNTR: SCHOTTKY RECTIFIER 60V D-PAK
F1 = 3568: No Description Available; Mfr_Name: Keystone Electronics; Type: DEV; Copyright: Copyright (C) 2022 Ultra Librarian. All rights reserved.; Manufacturer_Part_Number: 3568; Digi-Key_Part_Number_1: 1528-2397-ND; Digi-Key_Part_Number_2: 36-3568-ND; RefDes: RefDes
F2-F6 = Bel Fuse Inc. 0679H0500-05: FUSE BRD MNT 500MA 350VAC 72VDC; Fuse Type Cartridge: Board Mount (Cartridge Style Excluded); Voltage Rating - AC: 350V; Voltage Rating - DC: 72V; Breaking Capacity @ Rated Voltage: 50A AC, 100A DC; Melting I²t: 0.08; Manufacturer Part Number: 0679H0500-05; Manufacturer: Bel Fuse Inc.; Supplier 1: Digi-Key
J0 = 26013115: Conn Power HDR 4 POS 4.2mm Solder RA Thru-Hole 4 Terminal 1 Port Bag; Mfr_Name: Molex Connector Corporation; Manufacturer: Molex; Current Rating: 13A; Voltage Rating: 600V; Number of Positions: 4; Number of Ports: 1; Row Spacing: 0.165inch; Copyright: Copyright (C) 2021 Ultra Librarian. All rights reserved.; Manufacturer_Part_Number: 26013115; RefDes: RefDes; Type: DEV; Supplier 1: Digi-Key; Supplier Part Number 1: WM13112-ND; Manufacturer Part Number: 26-01-3115; RoHS: Yes; Category: Headers and Wire Housings; Stock 1: 12454; Pricing 1: 1=1.30000, 10=1.07300, 100=0.89400, 1000=0.71518, 5000=0.62578, 10000=0.59449 (USD); Mount: Through Hole; Contact Plating: Gold; Contact Material: Brass; Material: Brass; Housing Material: Nylon; Color: Natural; Min Operating Temperature: -40°C; Max Operating Temperature: 105°C; Termination: Solder; Orientation: Right Angle; Number of Rows: 2; Contact Gender: Male; Packaging: Tray; Package Quantity: 1320; Number of Contacts: 4; Fastening Type: Ramp; Series: Mini-Fit® Jr™ 5569; Contact Type: Male Pin; Length: 9.6mm; Pitch: 4.2mm; Radiation Hardening: No; REACH SVHC: No SVHC; ELV: Compliant; Flammability Rating: UL94 V-2; ComponentLink1URL: https://datasheet.ciiva.com/6814/039301100-sd-6814020.pdf?src-supplier=Digi-Key; ComponentLink1Description: https://datasheet.ciiva.com/6814/039301100-sd-6814020.pdf?src-supplier=Digi-Key; ComponentLink2URL: https://datasheet.ciiva.com/30235/0026013115-pcb-headers-30235692.pdf?src-supplier=Onlinecomponents.com; ComponentLink2Description: https://datasheet.ciiva.com/30235/0026013115-pcb-headers-30235692.pdf?src-supplier=Onlinecomponents.com; ComponentLink3URL: https://datasheet.ciiva.com/16654/0026013115-pcb-headers-16654666.pdf?src-supplier=Avnet+Europe; ComponentLink3Description: https://datasheet.ciiva.com/16654/0026013115-pcb-headers-16654666.pdf?src-supplier=Avnet+Europe
J1 = TE-776087-1: CONN HDR RTANG 23POS W/GASKT TIN; Supplier 1: Digi-Key
J2 = B5B-XH-A (LF)(SN): No Description Available; Mfr_Name: JST; Copyright: Copyright (C) 2021 Ultra Librarian. All rights reserved.; Manufacturer_Part_Number: B5B-XH-A (LF)(SN); RefDes: RefDes; Type: DEV
R4 R17 R18 = Resistor 0805: Res Thick Film 0805 0 Ohm Jumper 1/8W Molded SMD Paper T/R; Manufacturer: Stackpole Electronics; Manufacturer Part Number: RMCF0805ZT0R00; Power Rating: 125mW; Supplier 1: Digi-Key; Supplier Part Number 1: RMCF0805ZT0R00CT-ND; RoHS: Yes; Category: Chip SMD Resistors; Stock 1: 3965473; Pricing 1: 1=0.10000, 10=0.01700, 25=0.01280, 50=0.00960, 100=0.00710, 250=0.00540, 500=0.00432, 1000=0.00318 (USD); Mount: Surface Mount; Case/Package: 0805; Case Code (Metric): 2012; Case Code (Imperial): 0805; Contact Plating: Tin,Matte; Size Code: 0805; Min Operating Temperature: -55°C; Max Operating Temperature: 155°C; Packaging: Tape and Reel; Resistor Type: Thick Film; Number of Terminations: 2; Max Power Dissipation: 125mW; Features: Automotive AEC-Q200; Series: RMCF; Construction: Rectangular; Length: 2mm; Width: 0.049inch; Height: 0.026inch; Depth: 1.25mm; Radiation Hardening: No; Lead Free: Lead Free; Military Standard: Not; RoHS Compliant: Yes; ComponentLink1URL: https://datasheet.ciiva.com/15193/getdatasheetpartid-360417-15193658.pdf?src-supplier=Verical; ComponentLink1Description: https://datasheet.ciiva.com/15193/getdatasheetpartid-360417-15193658.pdf?src-supplier=Verical
R19 R20 = Resistor 0805: DNP; Resistance: DNP